# EAGLE design led-array-12x12 (EAGLE 7.3.0)
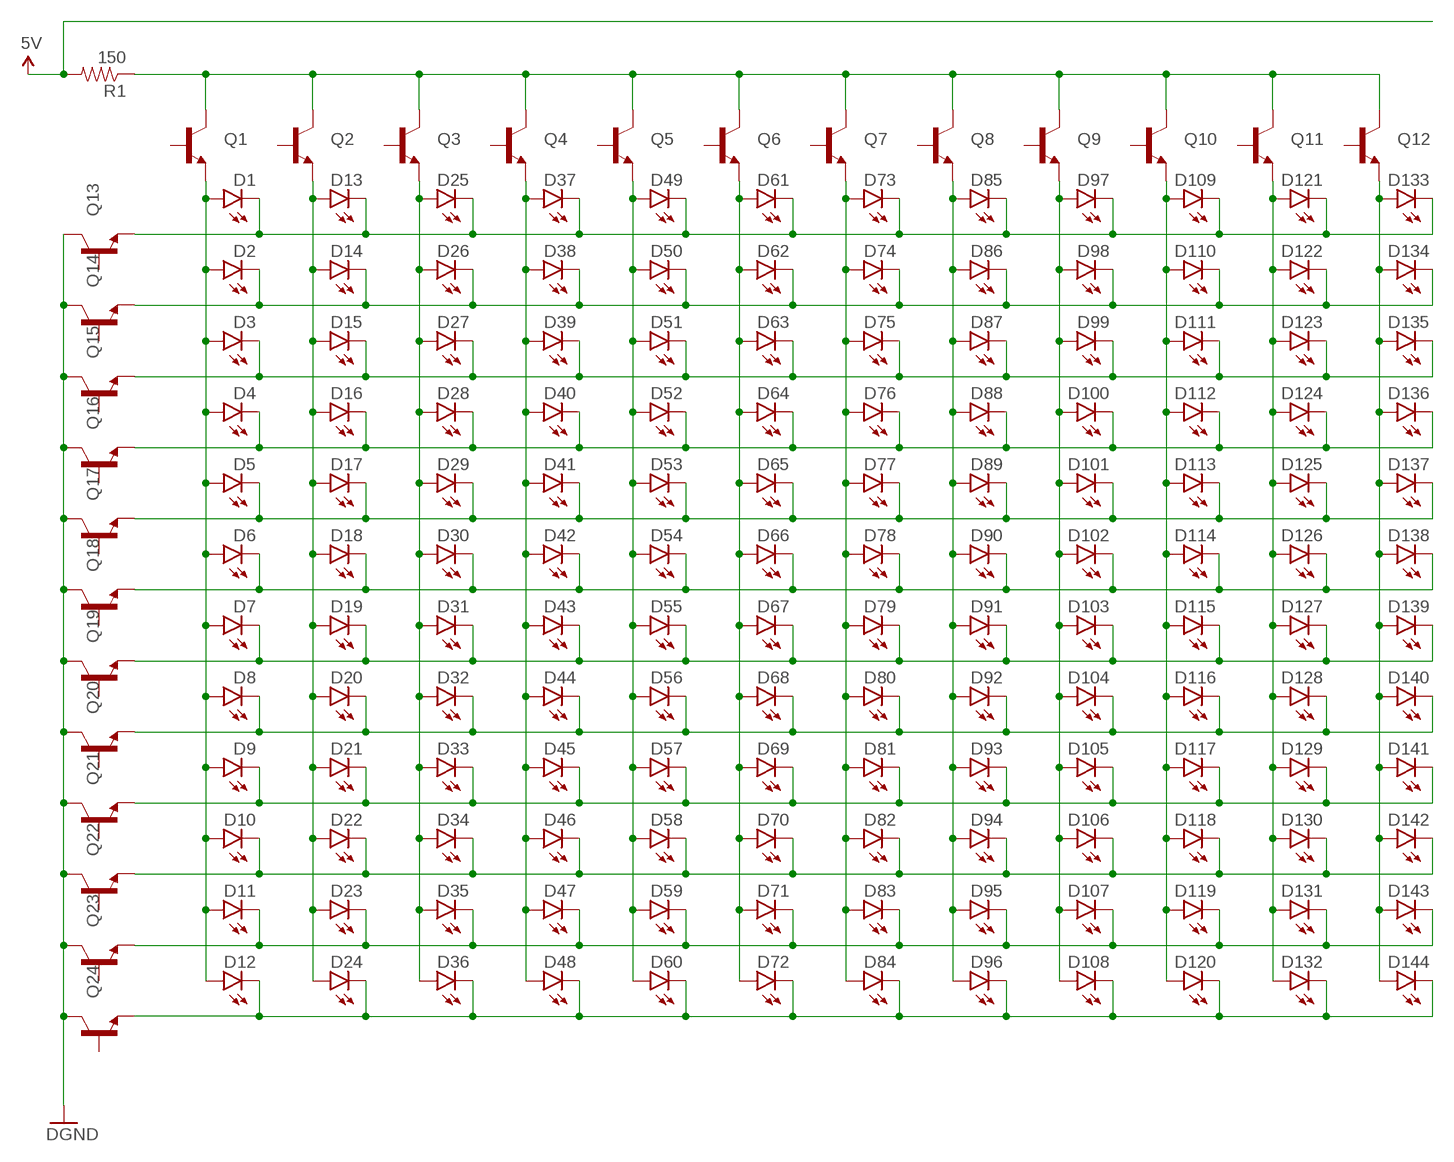
[diagram p0: schematic, sheet 1]

## Parts
D1  LED-IR-THRUTSAL6100  [LED5MM]
D2  LED-IR-THRUTSAL6100  [LED5MM]
D3  LED-IR-THRUTSAL6100  [LED5MM]
D4  LED-IR-THRUTSAL6100  [LED5MM]
D5  LED-IR-THRUTSAL6100  [LED5MM]
D6  LED-IR-THRUTSAL6100  [LED5MM]
D7  LED-IR-THRUTSAL6100  [LED5MM]
D8  LED-IR-THRUTSAL6100  [LED5MM]
D9  LED-IR-THRUTSAL6100  [LED5MM]
D10  LED-IR-THRUTSAL6100  [LED5MM]
D11  LED-IR-THRUTSAL6100  [LED5MM]
D12  LED-IR-THRUTSAL6100  [LED5MM]
D13  LED-IR-THRUTSAL6100  [LED5MM]
D14  LED-IR-THRUTSAL6100  [LED5MM]
D15  LED-IR-THRUTSAL6100  [LED5MM]
D16  LED-IR-THRUTSAL6100  [LED5MM]
D17  LED-IR-THRUTSAL6100  [LED5MM]
D18  LED-IR-THRUTSAL6100  [LED5MM]
D19  LED-IR-THRUTSAL6100  [LED5MM]
D20  LED-IR-THRUTSAL6100  [LED5MM]
D21  LED-IR-THRUTSAL6100  [LED5MM]
D22  LED-IR-THRUTSAL6100  [LED5MM]
D23  LED-IR-THRUTSAL6100  [LED5MM]
D24  LED-IR-THRUTSAL6100  [LED5MM]
D25  LED-IR-THRUTSAL6100  [LED5MM]
D26  LED-IR-THRUTSAL6100  [LED5MM]
D27  LED-IR-THRUTSAL6100  [LED5MM]
D28  LED-IR-THRUTSAL6100  [LED5MM]
D29  LED-IR-THRUTSAL6100  [LED5MM]
D30  LED-IR-THRUTSAL6100  [LED5MM]
D31  LED-IR-THRUTSAL6100  [LED5MM]
D32  LED-IR-THRUTSAL6100  [LED5MM]
D33  LED-IR-THRUTSAL6100  [LED5MM]
D34  LED-IR-THRUTSAL6100  [LED5MM]
D35  LED-IR-THRUTSAL6100  [LED5MM]
D36  LED-IR-THRUTSAL6100  [LED5MM]
D37  LED-IR-THRUTSAL6100  [LED5MM]
D38  LED-IR-THRUTSAL6100  [LED5MM]
D39  LED-IR-THRUTSAL6100  [LED5MM]
D40  LED-IR-THRUTSAL6100  [LED5MM]
D41  LED-IR-THRUTSAL6100  [LED5MM]
D42  LED-IR-THRUTSAL6100  [LED5MM]
D43  LED-IR-THRUTSAL6100  [LED5MM]
D44  LED-IR-THRUTSAL6100  [LED5MM]
D45  LED-IR-THRUTSAL6100  [LED5MM]
D46  LED-IR-THRUTSAL6100  [LED5MM]
D47  LED-IR-THRUTSAL6100  [LED5MM]
D48  LED-IR-THRUTSAL6100  [LED5MM]
D49  LED-IR-THRUTSAL6100  [LED5MM]
D50  LED-IR-THRUTSAL6100  [LED5MM]
D51  LED-IR-THRUTSAL6100  [LED5MM]
D52  LED-IR-THRUTSAL6100  [LED5MM]
D53  LED-IR-THRUTSAL6100  [LED5MM]
D54  LED-IR-THRUTSAL6100  [LED5MM]
D55  LED-IR-THRUTSAL6100  [LED5MM]
D56  LED-IR-THRUTSAL6100  [LED5MM]
D57  LED-IR-THRUTSAL6100  [LED5MM]
D58  LED-IR-THRUTSAL6100  [LED5MM]
D59  LED-IR-THRUTSAL6100  [LED5MM]
D60  LED-IR-THRUTSAL6100  [LED5MM]
D61  LED-IR-THRUTSAL6100  [LED5MM]
D62  LED-IR-THRUTSAL6100  [LED5MM]
D63  LED-IR-THRUTSAL6100  [LED5MM]
D64  LED-IR-THRUTSAL6100  [LED5MM]
D65  LED-IR-THRUTSAL6100  [LED5MM]
D66  LED-IR-THRUTSAL6100  [LED5MM]
D67  LED-IR-THRUTSAL6100  [LED5MM]
D68  LED-IR-THRUTSAL6100  [LED5MM]
D69  LED-IR-THRUTSAL6100  [LED5MM]
D70  LED-IR-THRUTSAL6100  [LED5MM]
D71  LED-IR-THRUTSAL6100  [LED5MM]
D72  LED-IR-THRUTSAL6100  [LED5MM]
D73  LED-IR-THRUTSAL6100  [LED5MM]
D74  LED-IR-THRUTSAL6100  [LED5MM]
D75  LED-IR-THRUTSAL6100  [LED5MM]
D76  LED-IR-THRUTSAL6100  [LED5MM]
D77  LED-IR-THRUTSAL6100  [LED5MM]
D78  LED-IR-THRUTSAL6100  [LED5MM]
D79  LED-IR-THRUTSAL6100  [LED5MM]
D80  LED-IR-THRUTSAL6100  [LED5MM]
D81  LED-IR-THRUTSAL6100  [LED5MM]
D82  LED-IR-THRUTSAL6100  [LED5MM]
D83  LED-IR-THRUTSAL6100  [LED5MM]
D84  LED-IR-THRUTSAL6100  [LED5MM]
D85  LED-IR-THRUTSAL6100  [LED5MM]
D86  LED-IR-THRUTSAL6100  [LED5MM]
D87  LED-IR-THRUTSAL6100  [LED5MM]
D88  LED-IR-THRUTSAL6100  [LED5MM]
D89  LED-IR-THRUTSAL6100  [LED5MM]
D90  LED-IR-THRUTSAL6100  [LED5MM]
D91  LED-IR-THRUTSAL6100  [LED5MM]
D92  LED-IR-THRUTSAL6100  [LED5MM]
D93  LED-IR-THRUTSAL6100  [LED5MM]
D94  LED-IR-THRUTSAL6100  [LED5MM]
D95  LED-IR-THRUTSAL6100  [LED5MM]
D96  LED-IR-THRUTSAL6100  [LED5MM]
D97  LED-IR-THRUTSAL6100  [LED5MM]
D98  LED-IR-THRUTSAL6100  [LED5MM]
D99  LED-IR-THRUTSAL6100  [LED5MM]
D100  LED-IR-THRUTSAL6100  [LED5MM]
D101  LED-IR-THRUTSAL6100  [LED5MM]
D102  LED-IR-THRUTSAL6100  [LED5MM]
D103  LED-IR-THRUTSAL6100  [LED5MM]
D104  LED-IR-THRUTSAL6100  [LED5MM]
D105  LED-IR-THRUTSAL6100  [LED5MM]
D106  LED-IR-THRUTSAL6100  [LED5MM]
D107  LED-IR-THRUTSAL6100  [LED5MM]
D108  LED-IR-THRUTSAL6100  [LED5MM]
D109  LED-IR-THRUTSAL6100  [LED5MM]
D110  LED-IR-THRUTSAL6100  [LED5MM]
D111  LED-IR-THRUTSAL6100  [LED5MM]
D112  LED-IR-THRUTSAL6100  [LED5MM]
D113  LED-IR-THRUTSAL6100  [LED5MM]
D114  LED-IR-THRUTSAL6100  [LED5MM]
D115  LED-IR-THRUTSAL6100  [LED5MM]
D116  LED-IR-THRUTSAL6100  [LED5MM]
D117  LED-IR-THRUTSAL6100  [LED5MM]
D118  LED-IR-THRUTSAL6100  [LED5MM]
D119  LED-IR-THRUTSAL6100  [LED5MM]
D120  LED-IR-THRUTSAL6100  [LED5MM]
D121  LED-IR-THRUTSAL6100  [LED5MM]
D122  LED-IR-THRUTSAL6100  [LED5MM]
D123  LED-IR-THRUTSAL6100  [LED5MM]
D124  LED-IR-THRUTSAL6100  [LED5MM]
D125  LED-IR-THRUTSAL6100  [LED5MM]
D126  LED-IR-THRUTSAL6100  [LED5MM]
D127  LED-IR-THRUTSAL6100  [LED5MM]
D128  LED-IR-THRUTSAL6100  [LED5MM]
D129  LED-IR-THRUTSAL6100  [LED5MM]
D130  LED-IR-THRUTSAL6100  [LED5MM]
D131  LED-IR-THRUTSAL6100  [LED5MM]
D132  LED-IR-THRUTSAL6100  [LED5MM]
D133  LED-IR-THRUTSAL6100  [LED5MM]
D134  LED-IR-THRUTSAL6100  [LED5MM]
D135  LED-IR-THRUTSAL6100  [LED5MM]
D136  LED-IR-THRUTSAL6100  [LED5MM]
D137  LED-IR-THRUTSAL6100  [LED5MM]
D138  LED-IR-THRUTSAL6100  [LED5MM]
D139  LED-IR-THRUTSAL6100  [LED5MM]
D140  LED-IR-THRUTSAL6100  [LED5MM]
D141  LED-IR-THRUTSAL6100  [LED5MM]
D142  LED-IR-THRUTSAL6100  [LED5MM]
D143  LED-IR-THRUTSAL6100  [LED5MM]
D144  LED-IR-THRUTSAL6100  [LED5MM]
Q1  TRANSISTOR_NPNMMBT2222A  [SOT23-3]
Q2  TRANSISTOR_NPNMMBT2222A  [SOT23-3]
Q3  TRANSISTOR_NPNMMBT2222A  [SOT23-3]
Q4  TRANSISTOR_NPNMMBT2222A  [SOT23-3]
Q5  TRANSISTOR_NPNMMBT2222A  [SOT23-3]
Q6  TRANSISTOR_NPNMMBT2222A  [SOT23-3]
Q7  TRANSISTOR_NPNMMBT2222A  [SOT23-3]
Q8  TRANSISTOR_NPNMMBT2222A  [SOT23-3]
Q9  TRANSISTOR_NPNMMBT2222A  [SOT23-3]
Q10  TRANSISTOR_NPNMMBT2222A  [SOT23-3]
Q11  TRANSISTOR_NPNMMBT2222A  [SOT23-3]
Q12  TRANSISTOR_NPNMMBT2222A  [SOT23-3]
Q13  TRANSISTOR_NPNMMBT2222A  [SOT23-3]
Q14  TRANSISTOR_NPNMMBT2222A  [SOT23-3]
Q15  TRANSISTOR_NPNMMBT2222A  [SOT23-3]
Q16  TRANSISTOR_NPNMMBT2222A  [SOT23-3]
Q17  TRANSISTOR_NPNMMBT2222A  [SOT23-3]
Q18  TRANSISTOR_NPNMMBT2222A  [SOT23-3]
Q19  TRANSISTOR_NPNMMBT2222A  [SOT23-3]
Q20  TRANSISTOR_NPNMMBT2222A  [SOT23-3]
Q21  TRANSISTOR_NPNMMBT2222A  [SOT23-3]
Q22  TRANSISTOR_NPNMMBT2222A  [SOT23-3]
Q23  TRANSISTOR_NPNMMBT2222A  [SOT23-3]
Q24  TRANSISTOR_NPNMMBT2222A  [SOT23-3]
R1  150  RESISTOR0805-RES  [0805]

## Nets
5V: R1.2
GND: Q13.3(C) Q14.3(C) Q15.3(C) Q16.3(C) Q17.3(C) Q18.3(C) Q19.3(C) Q20.3(C) Q21.3(C) Q22.3(C) Q23.3(C) Q24.3(C) ; supply symbol labelled DGND
N$1: D1.A D2.A D3.A D4.A D5.A D6.A D7.A D8.A D9.A D10.A D11.A D12.A Q1.2(E)
N$2: D13.A D14.A D15.A D16.A D17.A D18.A D19.A D20.A D21.A D22.A D23.A D24.A Q2.2(E)
N$3: D25.A D26.A D27.A D28.A D29.A D30.A D31.A D32.A D33.A D34.A D35.A D36.A Q3.2(E)
N$4: D37.A D38.A D39.A D40.A D41.A D42.A D43.A D44.A D45.A D46.A D47.A D48.A Q4.2(E)
N$5: D49.A D50.A D51.A D52.A D53.A D54.A D55.A D56.A D57.A D58.A D59.A D60.A Q5.2(E)
N$6: D61.A D62.A D63.A D64.A D65.A D66.A D67.A D68.A D69.A D70.A D71.A D72.A Q6.2(E)
N$7: D73.A D74.A D75.A D76.A D77.A D78.A D79.A D80.A D81.A D82.A D83.A D84.A Q7.2(E)
N$8: D85.A D86.A D87.A D88.A D89.A D90.A D91.A D92.A D93.A D94.A D95.A D96.A Q8.2(E)
N$9: D97.A D98.A D99.A D100.A D101.A D102.A D103.A D104.A D105.A D106.A D107.A D108.A Q9.2(E)
N$10: D109.A D110.A D111.A D112.A D113.A D114.A D115.A D116.A D117.A D118.A D119.A D120.A Q10.2(E)
N$11: D121.A D122.A D123.A D124.A D125.A D126.A D127.A D128.A D129.A D130.A D131.A D132.A Q11.2(E)
N$12: D133.A D134.A D135.A D136.A D137.A D138.A D139.A D140.A D141.A D142.A D143.A D144.A Q12.2(E)
N$13: D1.K(C) D13.K(C) D25.K(C) D37.K(C) D49.K(C) D61.K(C) D73.K(C) D85.K(C) D97.K(C) D109.K(C) D121.K(C) D133.K(C) Q13.2(E)
N$14: D2.K(C) D14.K(C) D26.K(C) D38.K(C) D50.K(C) D62.K(C) D74.K(C) D86.K(C) D98.K(C) D110.K(C) D122.K(C) D134.K(C) Q14.2(E)
N$15: D8.K(C) D20.K(C) D32.K(C) D44.K(C) D56.K(C) D68.K(C) D80.K(C) D92.K(C) D104.K(C) D116.K(C) D128.K(C) D140.K(C) Q20.2(E)
N$16: D3.K(C) D15.K(C) D27.K(C) D39.K(C) D51.K(C) D63.K(C) D75.K(C) D87.K(C) D99.K(C) D111.K(C) D123.K(C) D135.K(C) Q15.2(E)
N$17: Q1.3(C) Q2.3(C) Q3.3(C) Q4.3(C) Q5.3(C) Q6.3(C) Q7.3(C) Q8.3(C) Q9.3(C) Q10.3(C) Q11.3(C) Q12.3(C) R1.1
N$18: D4.K(C) D16.K(C) D28.K(C) D40.K(C) D52.K(C) D64.K(C) D76.K(C) D88.K(C) D100.K(C) D112.K(C) D124.K(C) D136.K(C) Q16.2(E)
N$19: D5.K(C) D17.K(C) D29.K(C) D41.K(C) D53.K(C) D65.K(C) D77.K(C) D89.K(C) D101.K(C) D113.K(C) D125.K(C) D137.K(C) Q17.2(E)
N$20: D6.K(C) D18.K(C) D30.K(C) D42.K(C) D54.K(C) D66.K(C) D78.K(C) D90.K(C) D102.K(C) D114.K(C) D126.K(C) D138.K(C) Q18.2(E)
N$21: D7.K(C) D19.K(C) D31.K(C) D43.K(C) D55.K(C) D67.K(C) D79.K(C) D91.K(C) D103.K(C) D115.K(C) D127.K(C) D139.K(C) Q19.2(E)
N$22: D9.K(C) D21.K(C) D33.K(C) D45.K(C) D57.K(C) D69.K(C) D81.K(C) D93.K(C) D105.K(C) D117.K(C) D129.K(C) D141.K(C) Q21.2(E)
N$23: D10.K(C) D22.K(C) D34.K(C) D46.K(C) D58.K(C) D70.K(C) D82.K(C) D94.K(C) D106.K(C) D118.K(C) D130.K(C) D142.K(C) Q22.2(E)
N$24: D11.K(C) D23.K(C) D35.K(C) D47.K(C) D59.K(C) D71.K(C) D83.K(C) D95.K(C) D107.K(C) D119.K(C) D131.K(C) D143.K(C) Q23.2(E)
N$26: D12.K(C) D24.K(C) D36.K(C) D48.K(C) D60.K(C) D72.K(C) D84.K(C) D96.K(C) D108.K(C) D120.K(C) D132.K(C) D144.K(C) Q24.2(E)
Unconnected: Q1.1(B) Q2.1(B) Q3.1(B) Q4.1(B) Q5.1(B) Q6.1(B) Q7.1(B) Q8.1(B) Q9.1(B) Q10.1(B) Q11.1(B) Q12.1(B) Q13.1(B) Q14.1(B) Q15.1(B) Q16.1(B) Q17.1(B) Q18.1(B) Q19.1(B) Q20.1(B) Q21.1(B) Q22.1(B) Q23.1(B) Q24.1(B)

## Library data of the parts
D1-D144 = SparkFun-LED:LED-IR-THRU; PROD_ID: DIO-12058
Q1-Q24 = SparkFun-DiscreteSemi:TRANSISTOR_NPN: Generic NPN BJT MMBT2222A - TRANS-08049 (SOT-23, 1A 40V) MPSA42 - TRANS-09116 (SOT-23, 500mA 300V) MMBT5088LT1G - TRANS-11160 (SOT-23, 50 mA 30V) BC547 - COM-08928 <http://www.sparkfun.com/products/8928> (TO-92 45V 100mA) (1.Collector 2.Base 3.Emitter) 2N3904 - COM-00521 <http://www.sparkfun.com/products/521> (TO-92 40V 200mA) (1.Emitter 2.Base 3.Collector) P2N2222A - COM-12852 <http://www.sparkfun.com/products/12852> (TO-92 40V 600mA) (1.Collector 2.Base 3.Emitter); PROD_ID: TRANS-08049; VALUE: MMBT2222A
R1 = SparkFun-Passives:RESISTOR: Resistor Basic schematic elements and footprints for 0603, 1206, and PTH resistors.

## Board
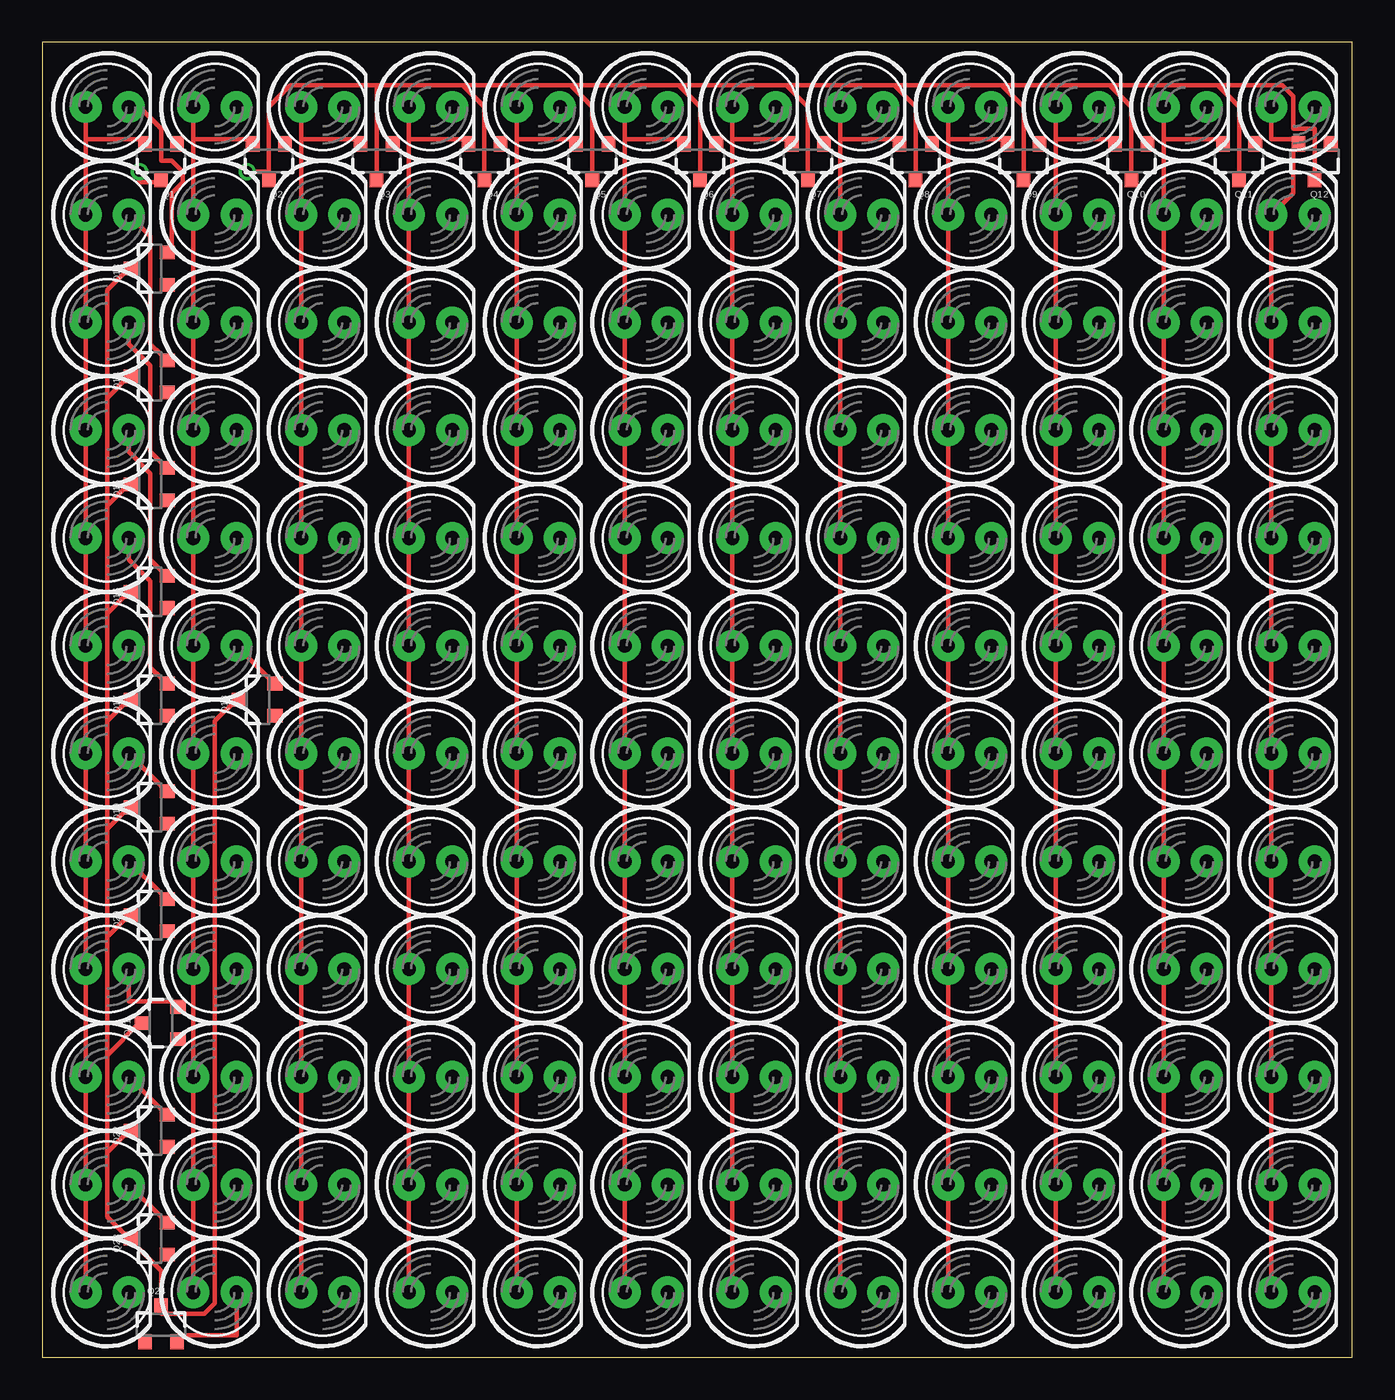
[diagram p1: board, top side]
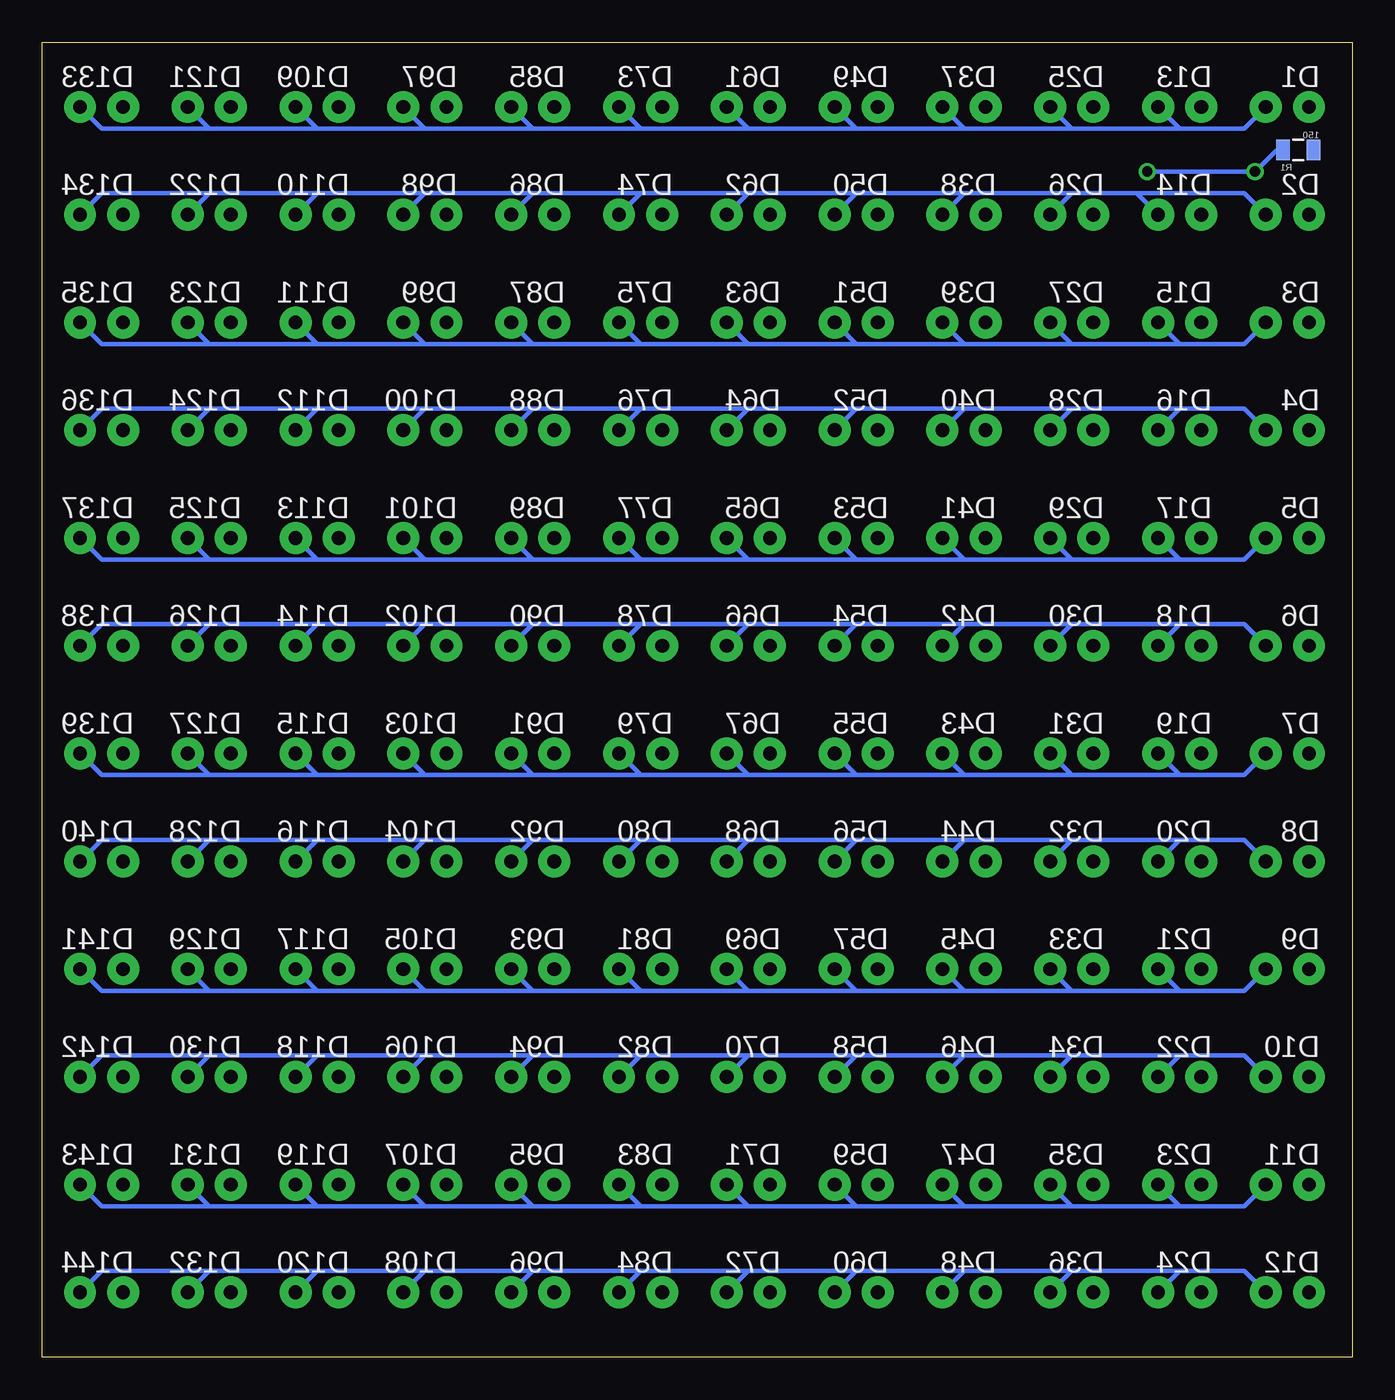
[diagram p2: board, bottom side, seen from below]

Size 77.14 x 77.46 mm. Coordinates in mm from the lower left corner, seen from the top.
Outline: 0,0 77.14,0 77.14,77.46 0,77.46 0,0
Copper layers (1*16): Top 0.035mm / dielectric 1.5mm / Bottom 0.035mm
Design rules "default": minimum track width 10mil, minimum drill 24mil, track to track 8mil, track to pad 8mil, pad to pad 8mil, via to via 8mil, smd to smd 8mil, copper to edge 40mil, drill to drill 8mil, minimum pad ring 10mil, minimum via ring 8mil, stop-mask expansion 4mil, vias tented up to drill 0mil, thermal gap 10mil

### Footprints (pad centres in the part's own frame; a part is rotated, then mirrored left to right if it is on the bottom)
LED5MM = drill 0.813 pad 1.88: A -1.27,0; K 1.27,0
SOT23-3 = smd 0.8 x 0.9: 1 -0.95,-1; 2 0.95,-1; 3 0,1.1
0805 = smd 0.8 x 1.2 bottom: 1 -0.9,0; 2 0.9,0

### Placement (x,y rotation side)
D1  3.81,73.66 0 top
D2  3.81,67.31 0 top
D3  3.81,60.96 0 top
D4  3.81,54.61 0 top
D5  3.81,48.26 0 top
D6  3.81,41.91 0 top
D7  3.81,35.56 0 top
D8  3.81,29.21 0 top
D9  3.81,22.86 0 top
D10  3.81,16.51 0 top
D11  3.81,10.16 0 top
D12  3.81,3.81 0 top
D13  10.16,73.66 0 top
D14  10.16,67.31 0 top
D15  10.16,60.96 0 top
D16  10.16,54.61 0 top
D17  10.16,48.26 0 top
D18  10.16,41.91 0 top
D19  10.16,35.56 0 top
D20  10.16,29.21 0 top
D21  10.16,22.86 0 top
D22  10.16,16.51 0 top
D23  10.16,10.16 0 top
D24  10.16,3.81 0 top
D25  16.51,73.66 0 top
D26  16.51,67.31 0 top
D27  16.51,60.96 0 top
D28  16.51,54.61 0 top
D29  16.51,48.26 0 top
D30  16.51,41.91 0 top
D31  16.51,35.56 0 top
D32  16.51,29.21 0 top
D33  16.51,22.86 0 top
D34  16.51,16.51 0 top
D35  16.51,10.16 0 top
D36  16.51,3.81 0 top
D37  22.86,73.66 0 top
D38  22.86,67.31 0 top
D39  22.86,60.96 0 top
D40  22.86,54.61 0 top
D41  22.86,48.26 0 top
D42  22.86,41.91 0 top
D43  22.86,35.56 0 top
D44  22.86,29.21 0 top
D45  22.86,22.86 0 top
D46  22.86,16.51 0 top
D47  22.86,10.16 0 top
D48  22.86,3.81 0 top
D49  29.21,73.66 0 top
D50  29.21,67.31 0 top
D51  29.21,60.96 0 top
D52  29.21,54.61 0 top
D53  29.21,48.26 0 top
D54  29.21,41.91 0 top
D55  29.21,35.56 0 top
D56  29.21,29.21 0 top
D57  29.21,22.86 0 top
D58  29.21,16.51 0 top
D59  29.21,10.16 0 top
D60  29.21,3.81 0 top
D61  35.56,73.66 0 top
D62  35.56,67.31 0 top
D63  35.56,60.96 0 top
D64  35.56,54.61 0 top
D65  35.56,48.26 0 top
D66  35.56,41.91 0 top
D67  35.56,35.56 0 top
D68  35.56,29.21 0 top
D69  35.56,22.86 0 top
D70  35.56,16.51 0 top
D71  35.56,10.16 0 top
D72  35.56,3.81 0 top
D73  41.91,73.66 0 top
D74  41.91,67.31 0 top
D75  41.91,60.96 0 top
D76  41.91,54.61 0 top
D77  41.91,48.26 0 top
D78  41.91,41.91 0 top
D79  41.91,35.56 0 top
D80  41.91,29.21 0 top
D81  41.91,22.86 0 top
D82  41.91,16.51 0 top
D83  41.91,10.16 0 top
D84  41.91,3.81 0 top
D85  48.26,73.66 0 top
D86  48.26,67.31 0 top
D87  48.26,60.96 0 top
D88  48.26,54.61 0 top
D89  48.26,48.26 0 top
D90  48.26,41.91 0 top
D91  48.26,35.56 0 top
D92  48.26,29.21 0 top
D93  48.26,22.86 0 top
D94  48.26,16.51 0 top
D95  48.26,10.16 0 top
D96  48.26,3.81 0 top
D97  54.61,73.66 0 top
D98  54.61,67.31 0 top
D99  54.61,60.96 0 top
D100  54.61,54.61 0 top
D101  54.61,48.26 0 top
D102  54.61,41.91 0 top
D103  54.61,35.56 0 top
D104  54.61,29.21 0 top
D105  54.61,22.86 0 top
D106  54.61,16.51 0 top
D107  54.61,10.16 0 top
D108  54.61,3.81 0 top
D109  60.96,73.66 0 top
D110  60.96,67.31 0 top
D111  60.96,60.96 0 top
D112  60.96,54.61 0 top
D113  60.96,48.26 0 top
D114  60.96,41.91 0 top
D115  60.96,35.56 0 top
D116  60.96,29.21 0 top
D117  60.96,22.86 0 top
D118  60.96,16.51 0 top
D119  60.96,10.16 0 top
D120  60.96,3.81 0 top
D121  67.31,73.66 0 top
D122  67.31,67.31 0 top
D123  67.31,60.96 0 top
D124  67.31,54.61 0 top
D125  67.31,48.26 0 top
D126  67.31,41.91 0 top
D127  67.31,35.56 0 top
D128  67.31,29.21 0 top
D129  67.31,22.86 0 top
D130  67.31,16.51 0 top
D131  67.31,10.16 0 top
D132  67.31,3.81 0 top
D133  73.66,73.66 0 top
D134  73.66,67.31 0 top
D135  73.66,60.96 0 top
D136  73.66,54.61 0 top
D137  73.66,48.26 0 top
D138  73.66,41.91 0 top
D139  73.66,35.56 0 top
D140  73.66,29.21 0 top
D141  73.66,22.86 0 top
D142  73.66,16.51 0 top
D143  73.66,10.16 0 top
D144  73.66,3.81 0 top
Q1  6.99,70.48 180 top
Q2  13.34,70.48 180 top
Q3  19.68,70.48 180 top
Q4  26.04,70.48 180 top
Q5  32.38,70.48 180 top
Q6  38.73,70.48 180 top
Q7  45.09,70.48 180 top
Q8  51.44,70.48 180 top
Q9  57.78,70.48 180 top
Q10  64.14,70.48 180 top
Q11  70.48,70.48 180 top
Q12  74.93,70.48 180 top
Q13  6.35,64.14 90 top
Q14  6.35,57.78 90 top
Q15  6.35,51.44 90 top
Q16  6.35,45.09 90 top
Q17  6.35,38.73 90 top
Q18  12.7,38.73 90 top
Q19  6.35,32.38 90 top
Q20  6.35,26.04 90 top
Q21  6.99,19.68 90 top
Q22  6.35,13.34 90 top
Q23  6.35,6.99 90 top
Q24  6.99,1.91 0 top
R1  3.17,71.12 180 top

### Tracks (layer width: path | path; a pad name or v marks a point on that pad's centre or on a via)
GND
  Top 0.254: 5.08,6.99 6.99,5.08 6.99,3.17 Q24.3 6.99,2.54 9.53,2.54 10.16,3.17 10.16,37.47 11.43,38.73 Q18.3 | 3.81,12.06 5.08,13.34 Q22.3 | 3.81,12.06 3.81,8.26 5.08,6.99 | 5.08,6.99 Q23.3 | 3.81,17.78 5.71,19.68 Q21.3 | 3.81,12.06 3.81,17.78 | 3.81,24.77 5.08,26.04 Q20.3 | 3.81,17.78 3.81,24.77 | 3.81,31.11 5.08,32.38 Q19.3 | 3.81,24.77 3.81,31.11 | 3.81,37.47 5.08,38.73 Q17.3 | 3.81,31.11 3.81,37.47 | 3.81,43.81 5.08,45.09 Q16.3 | 3.81,37.47 3.81,43.81 | 3.81,50.16 5.08,51.44 Q15.3 | 3.81,43.81 3.81,50.16 | 3.81,56.52 5.08,57.78 Q14.3 | 3.81,50.16 3.81,56.52 | 3.81,56.52 3.81,62.87 5.08,64.14 Q13.3
N$1
  Top 0.254: 2.54,71.75 5.71,71.75 Q1.2 | D1.A 2.54,71.75 | 2.54,71.75 D2.A D3.A D4.A D5.A D6.A D7.A D8.A D9.A D10.A D11.A D12.A
N$2
  Top 0.254: 8.89,71.75 12.06,71.75 Q2.2 | D13.A 8.89,71.75 | 8.89,71.75 D14.A D15.A D16.A D17.A D18.A D19.A D20.A D21.A D22.A D23.A D24.A
N$3
  Top 0.254: 15.24,71.75 18.41,71.75 Q3.2 | D25.A 15.24,71.75 | 15.24,71.75 D26.A D27.A D28.A D29.A D30.A D31.A D32.A D33.A D34.A D35.A D36.A
N$4
  Top 0.254: 21.59,71.75 24.77,71.75 Q4.2 | D37.A 21.59,71.75 | 21.59,71.75 D38.A D39.A D40.A D41.A D42.A D43.A D44.A D45.A D46.A D47.A D48.A
N$5
  Top 0.254: 27.94,71.75 31.11,71.75 Q5.2 | D49.A 27.94,71.75 | 27.94,71.75 D50.A D51.A D52.A D53.A D54.A D55.A D56.A D57.A D58.A D59.A D60.A
N$6
  Top 0.254: 34.29,71.75 37.47,71.75 Q6.2 | D61.A 34.29,71.75 | 34.29,71.75 D62.A D63.A D64.A D65.A D66.A D67.A D68.A D69.A D70.A D71.A D72.A
N$7
  Top 0.254: 40.64,71.75 43.81,71.75 Q7.2 | D73.A 40.64,71.75 | 40.64,71.75 D74.A D75.A D76.A D77.A D78.A D79.A D80.A D81.A D82.A D83.A D84.A
N$8
  Top 0.254: 46.99,71.75 50.16,71.75 Q8.2 | D85.A 46.99,71.75 | 46.99,71.75 D86.A D87.A D88.A D89.A D90.A D91.A D92.A D93.A D94.A D95.A D96.A
N$9
  Top 0.254: 53.34,71.75 56.52,71.75 Q9.2 | D97.A 53.34,71.75 | 53.34,71.75 D98.A D99.A D100.A D101.A D102.A D103.A D104.A D105.A D106.A D107.A D108.A
N$10
  Top 0.254: 59.69,71.75 62.87,71.75 Q10.2 | D109.A 59.69,71.75 | 59.69,71.75 D110.A D111.A D112.A D113.A D114.A D115.A D116.A D117.A D118.A D119.A D120.A
N$11
  Top 0.254: 66.04,71.75 69.22,71.75 Q11.2 | D121.A 66.04,71.75 | 66.04,71.75 D122.A D123.A D124.A D125.A D126.A D127.A D128.A D129.A D130.A D131.A D132.A
N$12
  Top 0.254: D133.A 72.39,71.75 73.66,71.75 Q12.2 73.66,71.12 73.66,68.58 D134.A D135.A D136.A D137.A D138.A D139.A D140.A D141.A D142.A D143.A D144.A
N$13
  Top 0.254: D1.K 5.71,73.66 6.99,72.39 6.99,70.48 7.62,70.48 8.26,69.85 8.26,69.22 7.62,68.58 7.62,65.41 Q13.2
  Bottom 0.254: 10.16,72.39 D13.K | 10.16,72.39 6.35,72.39 D1.K | 16.51,72.39 D25.K | 10.16,72.39 16.51,72.39 | 22.86,72.39 D37.K | 16.51,72.39 22.86,72.39 | 29.21,72.39 D49.K | 22.86,72.39 29.21,72.39 | 35.56,72.39 D61.K | 29.21,72.39 35.56,72.39 | 41.91,72.39 D73.K | 35.56,72.39 41.91,72.39 | 48.26,72.39 D85.K | 41.91,72.39 48.26,72.39 | 54.61,72.39 D97.K | 48.26,72.39 54.61,72.39 | 60.96,72.39 D109.K | 54.61,72.39 60.96,72.39 | 67.31,72.39 D121.K | 60.96,72.39 67.31,72.39 | D133.K 73.66,72.39 67.31,72.39
N$14
  Top 0.254: D2.K 6.35,66.04 6.35,59.69 6.99,59.05 Q14.2
  Bottom 0.254: 12.7,68.58 D14.K | 16.51,68.58 12.7,68.58 | D26.K 16.51,68.58 | 22.86,68.58 D38.K | 16.51,68.58 22.86,68.58 | 29.21,68.58 D50.K | 22.86,68.58 29.21,68.58 | 35.56,68.58 D62.K | 29.21,68.58 35.56,68.58 | 41.91,68.58 D74.K | 35.56,68.58 41.91,68.58 | 48.26,68.58 D86.K | 41.91,68.58 48.26,68.58 | 54.61,68.58 D98.K | 48.26,68.58 54.61,68.58 | 60.96,68.58 D110.K | 54.61,68.58 60.96,68.58 | 67.31,68.58 D122.K | 60.96,68.58 67.31,68.58 | D134.K 73.66,68.58 67.31,68.58 | D2.K 6.35,68.58 12.7,68.58
N$15
  Top 0.254: D8.K 6.99,27.3 Q20.2
  Bottom 0.254: 10.16,30.48 D20.K | 10.16,30.48 6.35,30.48 D8.K | 16.51,30.48 D32.K | 10.16,30.48 16.51,30.48 | 22.86,30.48 D44.K | 16.51,30.48 22.86,30.48 | 29.21,30.48 D56.K | 22.86,30.48 29.21,30.48 | 35.56,30.48 D68.K | 29.21,30.48 35.56,30.48 | 41.91,30.48 D80.K | 35.56,30.48 41.91,30.48 | 48.26,30.48 D92.K | 41.91,30.48 48.26,30.48 | 54.61,30.48 D104.K | 48.26,30.48 54.61,30.48 | 60.96,30.48 D116.K | 54.61,30.48 60.96,30.48 | 67.31,30.48 D128.K | 60.96,30.48 67.31,30.48 | D140.K 73.66,30.48 67.31,30.48
N$16
  Top 0.254: D3.K 5.08,59.69 6.35,58.42 6.35,53.34 6.99,52.7 Q15.2
  Bottom 0.254: 10.16,59.69 D15.K | 10.16,59.69 6.35,59.69 D3.K | 16.51,59.69 D27.K | 10.16,59.69 16.51,59.69 | 22.86,59.69 D39.K | 16.51,59.69 22.86,59.69 | 29.21,59.69 D51.K | 22.86,59.69 29.21,59.69 | 35.56,59.69 D63.K | 29.21,59.69 35.56,59.69 | 41.91,59.69 D75.K | 35.56,59.69 41.91,59.69 | 48.26,59.69 D87.K | 41.91,59.69 48.26,59.69 | 54.61,59.69 D99.K | 48.26,59.69 54.61,59.69 | 60.96,59.69 D111.K | 54.61,59.69 60.96,59.69 | 67.31,59.69 D123.K | 60.96,59.69 67.31,59.69 | D135.K 73.66,59.69 67.31,59.69
N$17  (via drill 0.61)
  Top 0.254: v5.71,69.85 5.71,69.22 6.99,69.22 Q1.3 | 13.34,69.85 13.34,73.66 14.61,74.93 19.68,74.93 | 13.34,69.85 Q2.3 13.34,69.22 | 19.68,74.93 Q3.3 19.68,69.22 | 24.77,74.93 26.04,73.66 Q4.3 26.04,69.22 | 19.68,74.93 24.77,74.93 | 31.11,74.93 32.38,73.66 Q5.3 32.38,69.22 | 24.77,74.93 31.11,74.93 | 37.47,74.93 38.73,73.66 Q6.3 38.73,69.22 | 31.11,74.93 37.47,74.93 | 43.81,74.93 45.09,73.66 Q7.3 45.09,69.22 | 37.47,74.93 43.81,74.93 | 50.16,74.93 51.44,73.66 Q8.3 51.44,69.22 | 43.81,74.93 50.16,74.93 | 56.52,74.93 57.78,73.66 Q9.3 57.78,69.22 | 50.16,74.93 56.52,74.93 | 62.87,74.93 64.14,73.66 Q10.3 64.14,69.22 | 56.52,74.93 62.87,74.93 | 69.22,74.93 70.48,73.66 Q11.3 70.48,69.22 | 62.87,74.93 69.22,74.93 | 69.22,74.93 73.03,74.93 73.66,74.3 73.66,72.39 74.93,72.39 Q12.3 74.93,69.22 | 13.34,69.85 v12.06,69.85
  Bottom 0.254: R1.1 4.45,71.12 v5.71,69.85 v12.06,69.85
N$18
  Top 0.254: D4.K 5.08,53.34 6.35,52.07 6.35,46.99 6.99,46.35 Q16.2
  Bottom 0.254: 10.16,55.88 D16.K | 10.16,55.88 6.35,55.88 D4.K | 16.51,55.88 D28.K | 10.16,55.88 16.51,55.88 | 22.86,55.88 D40.K | 16.51,55.88 22.86,55.88 | 29.21,55.88 D52.K | 22.86,55.88 29.21,55.88 | 35.56,55.88 D64.K | 29.21,55.88 35.56,55.88 | 41.91,55.88 D76.K | 35.56,55.88 41.91,55.88 | 48.26,55.88 D88.K | 41.91,55.88 48.26,55.88 | 54.61,55.88 D100.K | 48.26,55.88 54.61,55.88 | 60.96,55.88 D112.K | 54.61,55.88 60.96,55.88 | 67.31,55.88 D124.K | 60.96,55.88 67.31,55.88 | D136.K 73.66,55.88 67.31,55.88
N$19
  Top 0.254: D5.K 5.08,46.99 6.35,45.72 6.35,40.64 6.99,40.01 Q17.2
  Bottom 0.254: 10.16,46.99 D17.K | 10.16,46.99 6.35,46.99 D5.K | 16.51,46.99 D29.K | 10.16,46.99 16.51,46.99 | 22.86,46.99 D41.K | 16.51,46.99 22.86,46.99 | 29.21,46.99 D53.K | 22.86,46.99 29.21,46.99 | 35.56,46.99 D65.K | 29.21,46.99 35.56,46.99 | 41.91,46.99 D77.K | 35.56,46.99 41.91,46.99 | 48.26,46.99 D89.K | 41.91,46.99 48.26,46.99 | 54.61,46.99 D101.K | 48.26,46.99 54.61,46.99 | 60.96,46.99 D113.K | 54.61,46.99 60.96,46.99 | 67.31,46.99 D125.K | 60.96,46.99 67.31,46.99 | D137.K 73.66,46.99 67.31,46.99
N$20
  Top 0.254: D18.K 13.34,40.01 Q18.2
  Bottom 0.254: D6.K 6.35,43.18 10.16,43.18 | D18.K 10.16,43.18 | 16.51,43.18 D30.K | 10.16,43.18 16.51,43.18 | 22.86,43.18 D42.K | 16.51,43.18 22.86,43.18 | 29.21,43.18 D54.K | 22.86,43.18 29.21,43.18 | 35.56,43.18 D66.K | 29.21,43.18 35.56,43.18 | 41.91,43.18 D78.K | 35.56,43.18 41.91,43.18 | 48.26,43.18 D90.K | 41.91,43.18 48.26,43.18 | 54.61,43.18 D102.K | 48.26,43.18 54.61,43.18 | 60.96,43.18 D114.K | 54.61,43.18 60.96,43.18 | 67.31,43.18 D126.K | 60.96,43.18 67.31,43.18 | D138.K 73.66,43.18 67.31,43.18
N$21
  Top 0.254: D7.K 6.99,33.66 Q19.2
  Bottom 0.254: 10.16,34.29 D19.K | 10.16,34.29 6.35,34.29 D7.K | 16.51,34.29 D31.K | 10.16,34.29 16.51,34.29 | 22.86,34.29 D43.K | 16.51,34.29 22.86,34.29 | 29.21,34.29 D55.K | 22.86,34.29 29.21,34.29 | 35.56,34.29 D67.K | 29.21,34.29 35.56,34.29 | 41.91,34.29 D79.K | 35.56,34.29 41.91,34.29 | 48.26,34.29 D91.K | 41.91,34.29 48.26,34.29 | 54.61,34.29 D103.K | 48.26,34.29 54.61,34.29 | 60.96,34.29 D115.K | 54.61,34.29 60.96,34.29 | 67.31,34.29 D127.K | 60.96,34.29 67.31,34.29 | D139.K 73.66,34.29 67.31,34.29
N$22
  Top 0.254: D9.K 5.08,20.95 7.62,20.95 Q21.2
  Bottom 0.254: 10.16,21.59 D21.K | 10.16,21.59 6.35,21.59 D9.K | 16.51,21.59 D33.K | 10.16,21.59 16.51,21.59 | 22.86,21.59 D45.K | 16.51,21.59 22.86,21.59 | 29.21,21.59 D57.K | 22.86,21.59 29.21,21.59 | 35.56,21.59 D69.K | 29.21,21.59 35.56,21.59 | 41.91,21.59 D81.K | 35.56,21.59 41.91,21.59 | 48.26,21.59 D93.K | 41.91,21.59 48.26,21.59 | 54.61,21.59 D105.K | 48.26,21.59 54.61,21.59 | 60.96,21.59 D117.K | 54.61,21.59 60.96,21.59 | 67.31,21.59 D129.K | 60.96,21.59 67.31,21.59 | D141.K 73.66,21.59 67.31,21.59
N$23
  Top 0.254: D10.K 6.99,14.61 Q22.2
  Bottom 0.254: 10.16,17.78 D22.K | 10.16,17.78 6.35,17.78 D10.K | 16.51,17.78 D34.K | 10.16,17.78 16.51,17.78 | 22.86,17.78 D46.K | 16.51,17.78 22.86,17.78 | 29.21,17.78 D58.K | 22.86,17.78 29.21,17.78 | 35.56,17.78 D70.K | 29.21,17.78 35.56,17.78 | 41.91,17.78 D82.K | 35.56,17.78 41.91,17.78 | 48.26,17.78 D94.K | 41.91,17.78 48.26,17.78 | 54.61,17.78 D106.K | 48.26,17.78 54.61,17.78 | 60.96,17.78 D118.K | 54.61,17.78 60.96,17.78 | 67.31,17.78 D130.K | 60.96,17.78 67.31,17.78 | D142.K 73.66,17.78 67.31,17.78
N$24
  Top 0.254: D11.K 6.99,8.26 Q23.2
  Bottom 0.254: 10.16,8.89 D23.K | 10.16,8.89 6.35,8.89 D11.K | 16.51,8.89 D35.K | 10.16,8.89 16.51,8.89 | 22.86,8.89 D47.K | 16.51,8.89 22.86,8.89 | 29.21,8.89 D59.K | 22.86,8.89 29.21,8.89 | 35.56,8.89 D71.K | 29.21,8.89 35.56,8.89 | 41.91,8.89 D83.K | 35.56,8.89 41.91,8.89 | 48.26,8.89 D95.K | 41.91,8.89 48.26,8.89 | 54.61,8.89 D107.K | 48.26,8.89 54.61,8.89 | 60.96,8.89 D119.K | 54.61,8.89 60.96,8.89 | 67.31,8.89 D131.K | 60.96,8.89 67.31,8.89 | D143.K 73.66,8.89 67.31,8.89
N$26
  Top 0.254: D24.K 11.43,1.27 8.26,1.27 Q24.2
  Bottom 0.254: D12.K 6.35,5.08 10.16,5.08 | D24.K 10.16,5.08 | 16.51,5.08 D36.K | 10.16,5.08 16.51,5.08 | 22.86,5.08 D48.K | 16.51,5.08 22.86,5.08 | 29.21,5.08 D60.K | 22.86,5.08 29.21,5.08 | 35.56,5.08 D72.K | 29.21,5.08 35.56,5.08 | 41.91,5.08 D84.K | 35.56,5.08 41.91,5.08 | 48.26,5.08 D96.K | 41.91,5.08 48.26,5.08 | 54.61,5.08 D108.K | 48.26,5.08 54.61,5.08 | 60.96,5.08 D120.K | 54.61,5.08 60.96,5.08 | 67.31,5.08 D132.K | 60.96,5.08 67.31,5.08 | D144.K 73.66,5.08 67.31,5.08